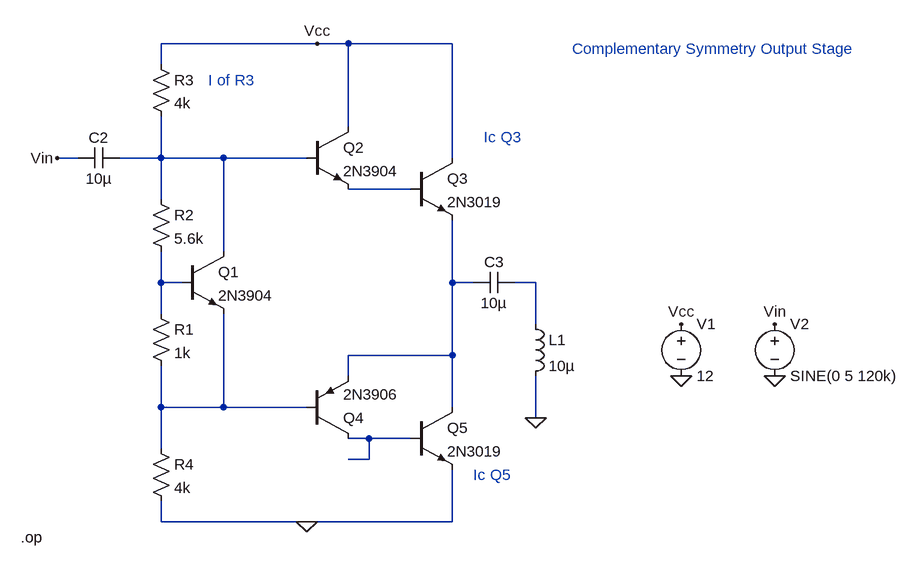
[diagram p0: schematic CompSym_OutputStage.asc]
CompSym_OutputStage.asc, the LTspice schematic file:
Version 4
SHEET 1 1188 680
WIRE 272 -192 32 -192
WIRE 320 -192 272 -192
WIRE 400 -192 320 -192
WIRE 480 -192 400 -192
WIRE 32 -160 32 -192
WIRE 320 -64 320 -192
WIRE -96 -16 -128 -16
WIRE 32 -16 32 -80
WIRE 32 -16 -32 -16
WIRE 128 -16 32 -16
WIRE 208 -16 128 -16
WIRE 256 -16 208 -16
WIRE 480 -16 480 -192
WIRE 416 32 320 32
WIRE 32 48 32 -16
WIRE 128 128 128 -16
WIRE 32 176 32 128
WIRE 64 176 32 176
WIRE 480 176 480 80
WIRE 512 176 480 176
WIRE 608 176 576 176
WIRE 32 224 32 176
WIRE 608 240 608 176
WIRE 480 288 480 176
WIRE 480 288 320 288
WIRE 320 320 320 288
WIRE 32 368 32 304
WIRE 128 368 128 224
WIRE 128 368 32 368
WIRE 208 368 128 368
WIRE 256 368 208 368
WIRE 480 368 480 288
WIRE 608 384 608 320
WIRE 352 416 320 416
WIRE 416 416 352 416
WIRE 32 432 32 368
WIRE 352 448 352 416
WIRE 352 448 320 448
WIRE 32 544 32 512
WIRE 256 544 32 544
WIRE 480 544 480 464
WIRE 480 544 256 544
FLAG 256 544 0
FLAG 832 320 0
FLAG 976 320 0
FLAG 272 -192 Vcc
FLAG 832 240 Vcc
FLAG 976 240 Vin
FLAG -128 -16 Vin
FLAG 608 384 0
DATAFLAG 208 -16 ""
DATAFLAG 208 368 ""
DATAFLAG 320 288 "Ie(Q4)"
DATAFLAG 480 176 ""
DATAFLAG 320 448 ""
DATAFLAG 32 176 ""
DATAFLAG 400 -192 ""
DATAFLAG 576 512 "Ic(Q5)"
DATAFLAG 592 0 "Ic(Q3)"
DATAFLAG 176 -96 "I(R3)"
DATAFLAG 304 64 "Ic(Q2)"
SYMBOL npn 64 128 R0
SYMATTR InstName Q1
SYMATTR Value 2N3904
SYMBOL res 16 208 R0
SYMATTR InstName R1
SYMATTR Value 1k
SYMBOL res 16 32 R0
SYMATTR InstName R2
SYMATTR Value 5.6k
SYMBOL res 16 -176 R0
SYMATTR InstName R3
SYMATTR Value 4k
SYMBOL res 16 416 R0
SYMATTR InstName R4
SYMATTR Value 4k
SYMBOL npn 256 -64 R0
SYMATTR InstName Q2
SYMATTR Value 2N3904
SYMBOL npn 416 -16 R0
SYMATTR InstName Q3
SYMATTR Value 2N3019
SYMBOL pnp 256 416 M180
SYMATTR InstName Q4
SYMATTR Value 2N3906
SYMBOL cap -96 0 R270
WINDOW 0 32 32 VTop 2
WINDOW 3 0 32 VBottom 2
SYMATTR InstName C2
SYMATTR Value 10µ
SYMBOL voltage 832 224 R0
WINDOW 123 0 0 Left 2
WINDOW 39 0 0 Left 2
SYMATTR InstName V1
SYMATTR Value 12
SYMBOL voltage 976 224 R0
WINDOW 123 0 0 Left 2
WINDOW 39 0 0 Left 2
SYMATTR InstName V2
SYMATTR Value SINE(0 5 120k)
SYMBOL ind 592 224 R0
SYMATTR InstName L1
SYMATTR Value 10µ
SYMBOL cap 512 192 R270
WINDOW 0 32 32 VTop 2
WINDOW 3 0 32 VBottom 2
SYMATTR InstName C3
SYMATTR Value 10µ
SYMBOL npn 416 368 R0
SYMATTR InstName Q5
SYMATTR Value 2N3019
TEXT -184 568 Left 2 !.op
TEXT 528 -48 Left 2 ;Ic Q3
TEXT 512 472 Left 2 ;Ic Q5
TEXT 104 -136 Left 2 ;I of R3
TEXT 664 -184 Left 2 ;Complementary Symmetry Output Stage

The netlist it stands for:
* CompSym_OutputStage.asc
Q1 N001 N003 N006 0 2N3904
R1 N003 N006 1k
R2 N001 N003 5.6k
R3 Vcc N001 4k
R4 N006 0 4k
Q2 Vcc N001 N002 0 2N3904
Q3 Vcc N002 N004 0 2N3019
Q4 N007 N006 N004 0 2N3906
C2 Vin N001 10µ
V1 Vcc 0 12
V2 Vin 0 SINE(0 5 120k)
L1 N005 0 10µ
C3 N004 N005 10µ
Q5 N004 N007 0 0 2N3019
.model NPN NPN
.model PNP PNP
.lib standard.bjt
.op
* Ic Q3
* Ic Q5
* I of R3
* Complementary Symmetry Output Stage
.backanno
.end